# Altium project MAX96724_COUPON.PrjPcb
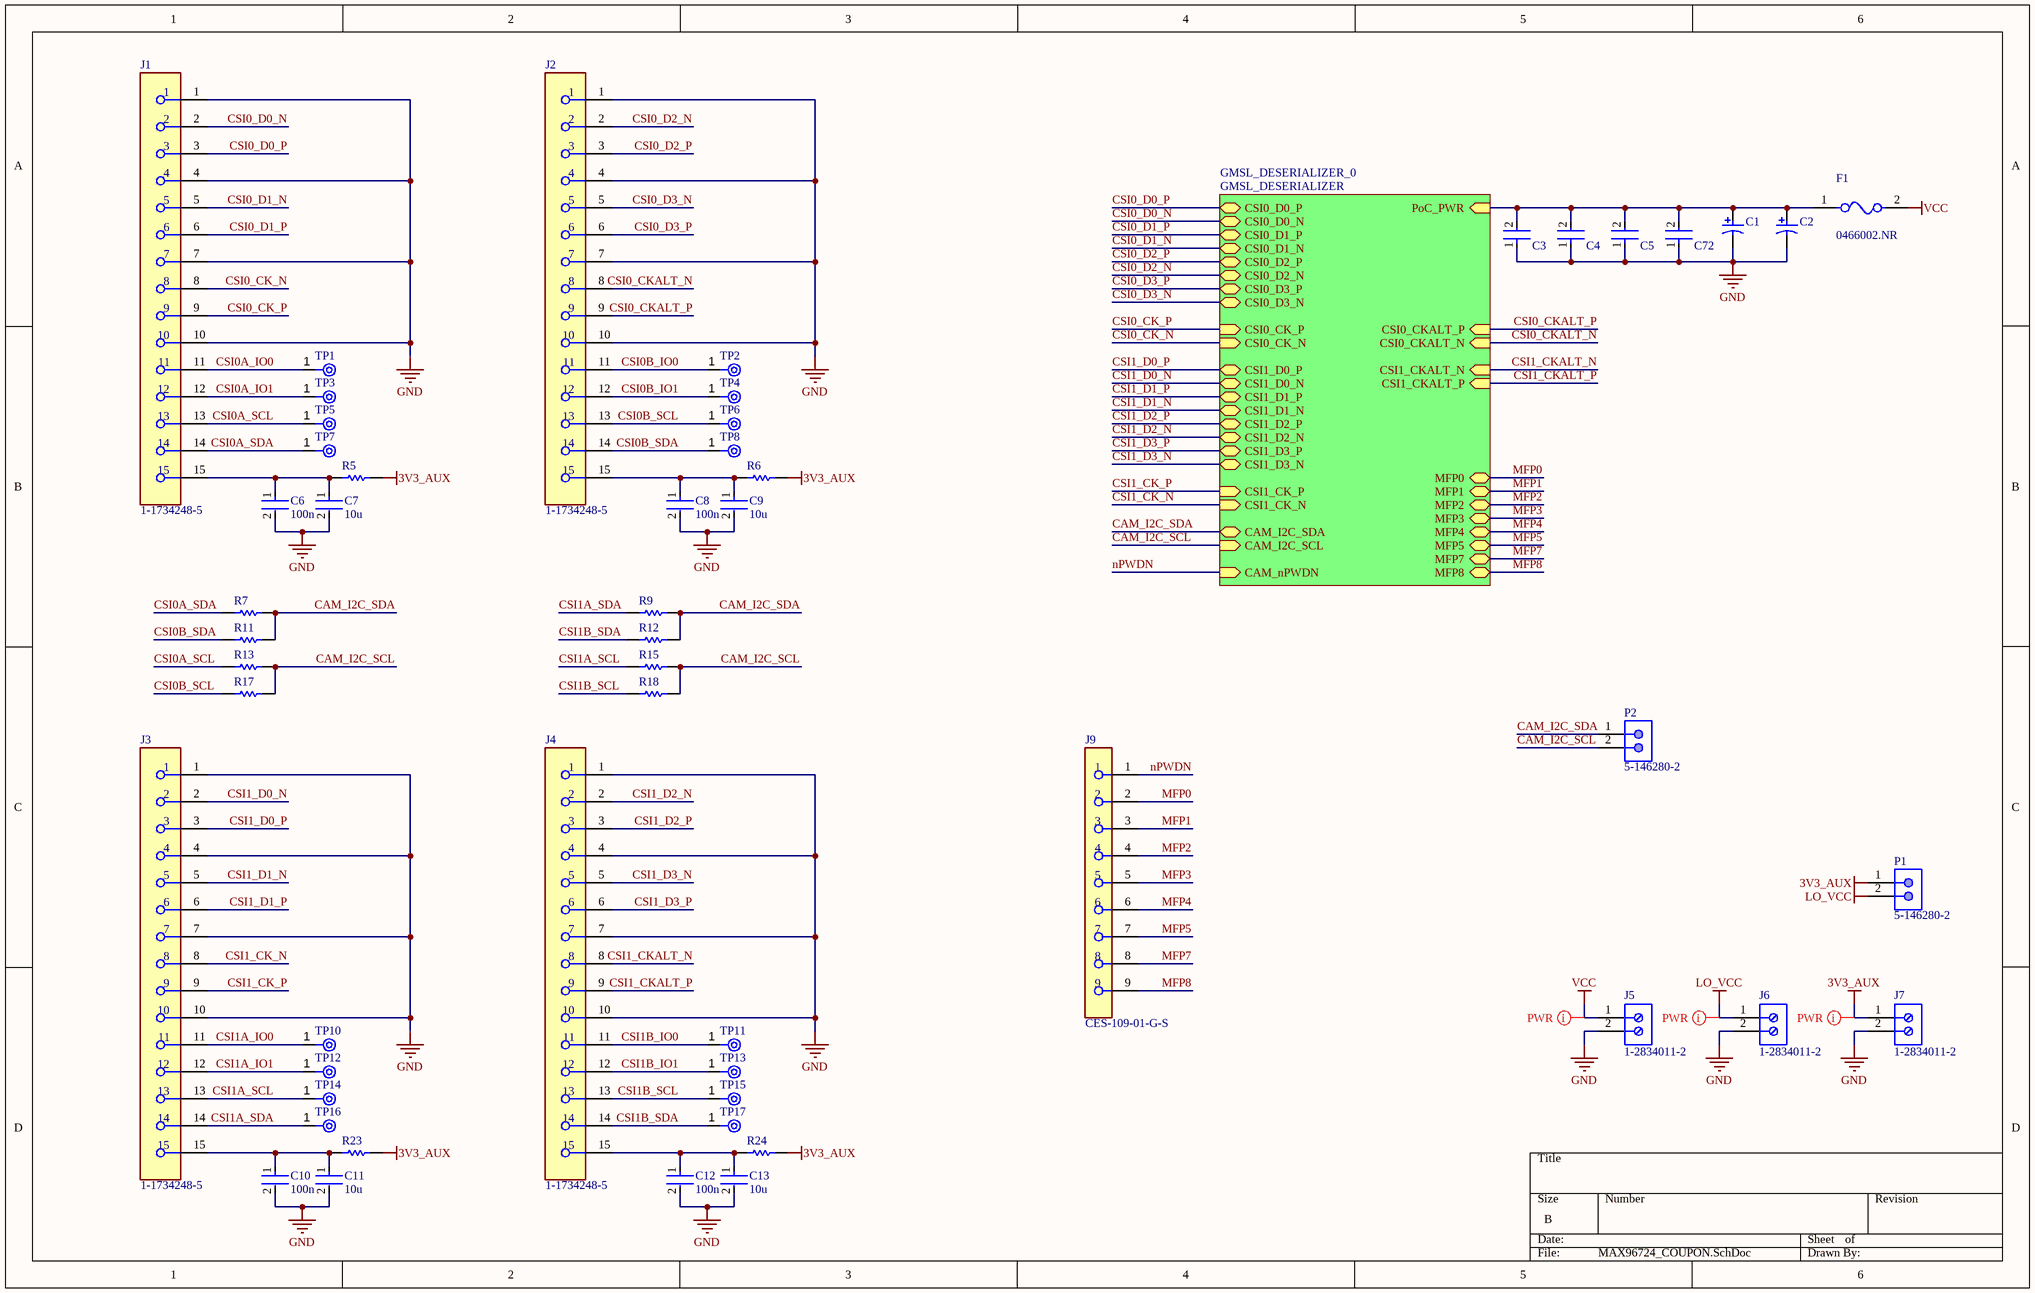
[diagram p0: MAX96724_COUPON.SchDoc]
2 sheets, 172 parts. Net scope: hierarchical (ports join the sheet entries above them; power ports are global).
Board file: MAX96724_COUPON.PcbDoc
Sheets:
  MAX96724_COUPON.SchDoc
    GMSL_DESERIALIZER_0 = GMSL_DESERIALIZER.SchDoc

## Sheet MAX96724_COUPON.SchDoc
size B; SheetNumber: 1; SheetTotal: 2

### Parts
C1  EEEFK1E101XP  [PNSC-FK-V-D8_V]  (value not drawn)
C2  EEEFK1E101XP  [PNSC-FK-V-D8_V]  (value not drawn)
C3  GRM21BR61E226ME44L  [FP-GRM21B-0_2-e0_2_0_7-IPC_B]  (value not drawn)
C4  GRM21BR61E226ME44L  [FP-GRM21B-0_2-e0_2_0_7-IPC_B]  (value not drawn)
C5  GRM21BR61E226ME44L  [FP-GRM21B-0_2-e0_2_0_7-IPC_B]  (value not drawn)
C6  100n  [FP-0402-L_1_0_0_05-W_0_5-IPC_A]
C7  10u  [FP-0402-L_1_0_0_05-W_0_5-IPC_A]
C8  100n  [FP-0402-L_1_0_0_05-W_0_5-IPC_A]
C9  10u  [FP-0402-L_1_0_0_05-W_0_5-IPC_A]
C10  100n  [FP-0402-L_1_0_0_05-W_0_5-IPC_A]
C11  10u  [FP-0402-L_1_0_0_05-W_0_5-IPC_A]
C12  100n  [FP-0402-L_1_0_0_05-W_0_5-IPC_A]
C13  10u  [FP-0402-L_1_0_0_05-W_0_5-IPC_A]
C72  GRM21BR61E226ME44L  [FP-GRM21B-0_2-e0_2_0_7-IPC_B]  (value not drawn)
F1  0466002.NR  [FP-0466-MFG]
J1  1-1734248-5  [FP-1-1734248-5-MFG]
J2  1-1734248-5  [FP-1-1734248-5-MFG]
J3  1-1734248-5  [FP-1-1734248-5-MFG]
J4  1-1734248-5  [FP-1-1734248-5-MFG]
J5  1-2834011-2  [1-2834011-2-Footprint-1]
J6  1-2834011-2  [1-2834011-2-Footprint-1]
J7  1-2834011-2  [1-2834011-2-Footprint-1]
J9  CES-109-01-G-S  [FP-CES-109-01-G-S-MFG]
P1  5-146280-2  [TECO-5-146280-2_V]
P2  5-146280-2  [TECO-5-146280-2_V]
R5  RC0402JR-070RL  [RESC1005X40X25NL05T10]  (value not drawn)
R6  RC0402JR-070RL  [RESC1005X40X25NL05T10]  (value not drawn)
R7  RC0402JR-070RL  [RESC1005X40X25NL05T10]  (value not drawn)
R9  RC0402JR-070RL  [RESC1005X40X25NL05T10]  (value not drawn)
R11  RC0402JR-070RL  [RESC1005X40X25NL05T10]  (value not drawn)
R12  RC0402JR-070RL  [RESC1005X40X25NL05T10]  (value not drawn)
R13  RC0402JR-070RL  [RESC1005X40X25NL05T10]  (value not drawn)
R15  RC0402JR-070RL  [RESC1005X40X25NL05T10]  (value not drawn)
R17  RC0402JR-070RL  [RESC1005X40X25NL05T10]  (value not drawn)
R18  RC0402JR-070RL  [RESC1005X40X25NL05T10]  (value not drawn)
R23  RC0402JR-070RL  [RESC1005X40X25NL05T10]  (value not drawn)
R24  RC0402JR-070RL  [RESC1005X40X25NL05T10]  (value not drawn)
TP1  TPAD6R  [New footprint 1]  (value not drawn)
TP2  TPAD6R  [New footprint 1]  (value not drawn)
TP3  TPAD6R  [New footprint 1]  (value not drawn)
TP4  TPAD6R  [New footprint 1]  (value not drawn)
TP5  TPAD6R  [New footprint 1]  (value not drawn)
TP6  TPAD6R  [New footprint 1]  (value not drawn)
TP7  TPAD6R  [New footprint 1]  (value not drawn)
TP8  TPAD6R  [New footprint 1]  (value not drawn)
TP10  TPAD6R  [New footprint 1]  (value not drawn)
TP11  TPAD6R  [New footprint 1]  (value not drawn)
TP12  TPAD6R  [New footprint 1]  (value not drawn)
TP13  TPAD6R  [New footprint 1]  (value not drawn)
TP14  TPAD6R  [New footprint 1]  (value not drawn)
TP15  TPAD6R  [New footprint 1]  (value not drawn)
TP16  TPAD6R  [New footprint 1]  (value not drawn)
TP17  TPAD6R  [New footprint 1]  (value not drawn)

### Sub-sheets
GMSL_DESERIALIZER_0 = GMSL_DESERIALIZER: CSI0_D0_P (bidir), CSI0_D0_N (bidir), CSI0_D1_P (bidir), CSI0_D1_N (bidir), CSI0_D2_P (bidir), CSI0_D2_N (bidir), CSI0_D3_P (bidir), CSI0_D3_N (bidir), CSI0_CK_P (in), CSI0_CK_N (in), CSI1_D0_P (bidir), CSI1_D0_N (bidir), CSI1_D1_P (bidir), CSI1_D1_N (bidir), CSI1_D2_P (bidir), CSI1_D2_N (bidir), CSI1_D3_P (bidir), CSI1_D3_N (bidir), CSI1_CK_P (in), CSI1_CK_N (in), CAM_I2C_SDA (bidir), CAM_I2C_SCL (in), CAM_nPWDN (in), PoC_PWR (in), MFP0 (bidir), MFP1 (bidir), MFP2 (bidir), MFP3 (bidir), MFP4 (bidir), MFP5 (bidir), MFP7 (bidir), MFP8 (bidir), CSI0_CKALT_P (in), CSI0_CKALT_N (in), CSI1_CKALT_P (in), CSI1_CKALT_N (in)

### Nets
3V3_AUX: J7.1 P1.1 R5.2 R6.2 R23.2 R24.2
GND: C1.2 C2.2 C3.1 C4.1 C5.1 C6.2 C7.2 C8.2 C9.2 C10.2 C11.2 C12.2 C13.2 C72.1 J1.1 J1.4 J1.7 J1.10 J2.1 J2.4 J2.7 J2.10 J3.1 J3.4 J3.7 J3.10 J4.1 J4.4 J4.7 J4.10 J5.2 J6.2 J7.2
LO_VCC: J6.1 P1.2
VCC: F1.2 J5.1
CAM_I2C_SCL: P2.2 R13.2 R15.2 R17.2 R18.2 ; sheet GMSL_DESERIALIZER_0/CAM_I2C_SCL
CAM_I2C_SDA: P2.1 R7.2 R9.2 R11.2 R12.2 ; sheet GMSL_DESERIALIZER_0/CAM_I2C_SDA
CSI0_CK_N: J1.8 ; sheet GMSL_DESERIALIZER_0/CSI0_CK_N
CSI0_CK_P: J1.9 ; sheet GMSL_DESERIALIZER_0/CSI0_CK_P
CSI0_CKALT_N: J2.8 ; sheet GMSL_DESERIALIZER_0/CSI0_CKALT_N
CSI0_CKALT_P: J2.9 ; sheet GMSL_DESERIALIZER_0/CSI0_CKALT_P
CSI0_D0_N: J1.2 ; sheet GMSL_DESERIALIZER_0/CSI0_D0_N
CSI0_D0_P: J1.3 ; sheet GMSL_DESERIALIZER_0/CSI0_D0_P
CSI0_D1_N: J1.5 ; sheet GMSL_DESERIALIZER_0/CSI0_D1_N
CSI0_D1_P: J1.6 ; sheet GMSL_DESERIALIZER_0/CSI0_D1_P
CSI0_D2_N: J2.2 ; sheet GMSL_DESERIALIZER_0/CSI0_D2_N
CSI0_D2_P: J2.3 ; sheet GMSL_DESERIALIZER_0/CSI0_D2_P
CSI0_D3_N: J2.5 ; sheet GMSL_DESERIALIZER_0/CSI0_D3_N
CSI0_D3_P: J2.6 ; sheet GMSL_DESERIALIZER_0/CSI0_D3_P
CSI0A_IO0: J1.11 TP1.1(TP)
CSI0A_IO1: J1.12 TP3.1(TP)
CSI0A_SCL: J1.13 R13.1 TP5.1(TP)
CSI0A_SDA: J1.14 R7.1 TP7.1(TP)
CSI0B_IO0: J2.11 TP2.1(TP)
CSI0B_IO1: J2.12 TP4.1(TP)
CSI0B_SCL: J2.13 R17.1 TP6.1(TP)
CSI0B_SDA: J2.14 R11.1 TP8.1(TP)
CSI1_CK_N: J3.8 ; sheet GMSL_DESERIALIZER_0/CSI1_CK_N
CSI1_CK_P: J3.9 ; sheet GMSL_DESERIALIZER_0/CSI1_CK_P
CSI1_CKALT_N: J4.8 ; sheet GMSL_DESERIALIZER_0/CSI1_CKALT_N
CSI1_CKALT_P: J4.9 ; sheet GMSL_DESERIALIZER_0/CSI1_CKALT_P
CSI1_D0_N: J3.2 ; sheet GMSL_DESERIALIZER_0/CSI1_D0_N
CSI1_D0_P: J3.3 ; sheet GMSL_DESERIALIZER_0/CSI1_D0_P
CSI1_D1_N: J3.5 ; sheet GMSL_DESERIALIZER_0/CSI1_D1_N
CSI1_D1_P: J3.6 ; sheet GMSL_DESERIALIZER_0/CSI1_D1_P
CSI1_D2_N: J4.2 ; sheet GMSL_DESERIALIZER_0/CSI1_D2_N
CSI1_D2_P: J4.3 ; sheet GMSL_DESERIALIZER_0/CSI1_D2_P
CSI1_D3_N: J4.5 ; sheet GMSL_DESERIALIZER_0/CSI1_D3_N
CSI1_D3_P: J4.6 ; sheet GMSL_DESERIALIZER_0/CSI1_D3_P
CSI1A_IO0: J3.11 TP10.1(TP)
CSI1A_IO1: J3.12 TP12.1(TP)
CSI1A_SCL: J3.13 R15.1 TP14.1(TP)
CSI1A_SDA: J3.14 R9.1 TP16.1(TP)
CSI1B_IO0: J4.11 TP11.1(TP)
CSI1B_IO1: J4.12 TP13.1(TP)
CSI1B_SCL: J4.13 R18.1 TP15.1(TP)
CSI1B_SDA: J4.14 R12.1 TP17.1(TP)
MFP0: J9.2 ; sheet GMSL_DESERIALIZER_0/MFP0
MFP1: J9.3 ; sheet GMSL_DESERIALIZER_0/MFP1
MFP2: J9.4 ; sheet GMSL_DESERIALIZER_0/MFP2
MFP3: J9.5 ; sheet GMSL_DESERIALIZER_0/MFP3
MFP4: J9.6 ; sheet GMSL_DESERIALIZER_0/MFP4
MFP5: J9.7 ; sheet GMSL_DESERIALIZER_0/MFP5
MFP7: J9.8 ; sheet GMSL_DESERIALIZER_0/MFP7
MFP8: J9.9 ; sheet GMSL_DESERIALIZER_0/MFP8
nPWDN: J9.1 ; sheet GMSL_DESERIALIZER_0/CAM_nPWDN
PoC_PWR: C1.1 C2.1 C3.2 C4.2 C5.2 C72.2 F1.1 ; sheet GMSL_DESERIALIZER_0/PoC_PWR
NetC6_1: C6.1 C7.1 J1.15 R5.1
NetC8_1: C8.1 C9.1 J2.15 R6.1
NetC10_1: C10.1 C11.1 J3.15 R23.1
NetC12_1: C12.1 C13.1 J4.15 R24.1

### Layout directives
net class PWR: 3V3_AUX, LO_VCC, VCC

### Library data of the parts
C1 C2 = CMP-2000-06206-1: Aluminum Electrolytic Capacitor, 100 uF, +/- 20%, 25 V, 2-Pin SMD (Size Code D8), -55 to 105 degC, RoHS, Tape and Reel; Manufacturer: Panasonic; Type: Can; Lifetime@Temperature: 2000Hrs@105°C; Capacitance: 100µF; Rated Voltage: 25V; Ripple Current: 280mA; Impedance: 0.34O; Case Size/Dimension: Ø6.3x7.7mm; Operating Temp-Max: 105°C; Series: FK; Package URL: http://industrial.panasonic.com/cdbs/www-data/pdf/RDE0000/DME0000COL48.pdf; Mounting Technology: SurfaceMount; Package Description: 2-Pin Electrolytic Aluminum Capacitor, Body 6.6 x 6.6 mm; Datasheet Version: 03/2016; Datasheet URL: http://industrial.panasonic.com/cdbs/www-data/pdf/RDE0000/ABA0000C1181.pdf; Manufacturer URL: http://www.panasonic.com/; Package Reference: FK-V-D8; Operating Temp Range: -55to+105°C
C3-C5 C72 = CMP-2007-03222-3: Chip Multilayer Ceramic Capacitors for General Purpose, 0805, 22uF, X5R, 15%, 20%, 25V; Case/Package: 0805; Depth: 1.25mm; Resistor Type: Ceramic; Voltage Rating: 25V; Lead Free: Lead Free; Voltage Rating (DC): 25V; Case Code (Metric): 2012; Thickness: 0.057inch; REACH SVHC: No SVHC; Material: Ceramic; Tolerance: 20%; Length: 2mm; Capacitance: 22uF; Case Code (Imperial): 0805; Max Operating Temperature: 85°C; Termination: SMD/SMT; Weight: 0.000335oz; Dielectric: X5R; Packaging: Tape and Reel; Voltage: 25V; Package Quantity: 3000; Height: 1.25mm; Mount: Surface Mount; Width: 1.25mm; Min Operating Temperature: -55°C
C6-C13 = CMP-001-00058-1: LARGE PADS, 0402 CAP, CHANGE COMMENT TO MATCH REAL P/N; Capacitor Type: Ceramic; Min Operating Temperature: -55°C; Mounting Technology: Surface Mount; Pins: 2; Case/Package: 0402; RoHS Compliant: Yes; Max Operating Temperature: 85°C
F1 = CMP-2000-05742-2: FUSE BOARD MNT 2A 63VAC/VDC 1206; Manufacturer: Littelfuse; Max Fuse Dc Voltage: 63V; Fuse I2T: 0.2326A2Sec; Fuse Voltage Drop: 78.73mV; Fuse Interrupt Ac Current: 50A; Resistance: 0.03Ω; Value: 0.03Ω; Fuse Blow Speed: Fast; Temperature Range Low: -55°C; Octopart: https://octopart.com/0466002.nr-littelfuse-566006; Category: Fuse; Digikey Description: FUSE BOARD MNT 2A 63VAC/VDC 1206; Height: 0.66mm; Temperature: -55°C to +90°C; ComponentLink2URL: https://www.littelfuse.com/~/media/electronics/datasheets/fuses/littelfuse_fuse_466_datasheet.pdf.pdf; Device Class L3: unset; Device Class L2: Fuses; Device Class L1: Circuit Protection; Lead Free: Yes; Mouser Description: 466 Series Very Fast-Acting 63 V 2 A 1206 Surface Mount Thin Film Fuse; Package: 0466; Fuse Current: 2A; Temperature Range High: +90°C; Voltage Rating: 63V; Manufacturer Part Number: 0466002.NR; Automotive: No; Max Fuse Ac Voltage: 63V; ComponentLink2Description: Datasheet; RoHS: TRUE; Fuse Interrupt Dc Current: 50A
J1-J4 = CMP-03368-000001-1: CONN FPC VERT 15POS 1.00MM SMD; Manufacturer: TE; Conn Orientation: Vertical; Conn Gender: Female; Current Rating: 1A; Is Female: yes; Number Of Contacts: 15; Pitch: 1mm; Voltage Rating: 125V; ComponentLink2URL: https://www.te.com/commerce/DocumentDelivery/DDEController?Action=showdoc&DocId=Customer+Drawing%7F1734248%7FE1%7Fpdf%7FEnglish%7FENG_CD_1734248_E1__.pdf%7F1-1734248-5; Device Class L1: Connectors; Category: Conn; Package: 0; Lead Free: Yes; Digikey Description: CONN FPC VERT 15POS 1.00MM SMD; Height: 8mm; Manufacturer Part Number: 1-1734248-5; Temperature: -20°C to +85°C; Contact Material: Gold,Nickel; Device Class L3: unset; ComponentLink2Description: Datasheet; RoHS: TRUE; Temperature Range Low: -20°C; Octopart: https://octopart.com/1-1734248-5-te+connectivity-40620898; Device Class L2: FFC / FPC; Mouser Description: FFC & FPC Connectors 15P 1.0 FPC, Zip V/T SMT; Automotive: No; Temperature Range High: +85°C; Mounting Type: Surface Mount
J5-J7 = CMP-002-00067-1: Barrier Strip Terminal Block; RoHS Compliant: Yes
J9 = CMP-00575-09340057-1: CES-109-01-G-S Conn Socket Strip SKT 9 POS 2.54mm Solder ST Top Entry Thru-Hole Tube; Manufacturer Lifecycle Status: PRODUCTION; Current Rating: 5.5A; Max Current Rating: 1A; Number of Contacts: 9; Max Voltage Rating (AC): 333V; Voltage Rating: 400V; Gender: Receptacle; Contact Resistance: 10mΩ; Depth: 3.05mm; NexarPartId: 9340057; Contact Plating: Gold; Termination: Solder; Housing Color: Black; REACH SVHC: No SVHC; Contact Material: Bronze, Gold, Nickel; Min Operating Temperature: -55°C; Radiation Hardening: No; Orientation: Straight; Length: 22.86mm; RoHS: Compliant; Housing Material: Polyester; Lifecycle Status: Production; Max Operating Temperature: 125°C; Pitch: 2.54mm; Height: 5.21mm; Number of Rows: 1
P1 P2 = CMP-2000-07492-1: Male Header, Pitch 2.54 mm, 1 x 2 Position, Height 8.21 mm, Tail Length 3.05 mm, -65 to 105 degC, RoHS, Bulk; Manufacturer: TE Connectivity; Mating Connector Lock: No(Without); Number of Positions: 2; Pitch: 2.54mm; PCB Mounting Orientation: Vertical; Keyed: No; Case\/Package: 100; Mating Post Length: 0.23inch; High Temperature Housing: Yes; Max Current Rating: 5A; PCB Thickness: 0.063inch; PCB Mount Retention: Without; Approvals: CSA; Current Rating: 3A; Radiation Hardening: No; Length: 4.67mm; Contact Mating Length: 0.23inch; Connector Type: Header; Number of Rows: 1; Termination Post Length: 0.12inch; Board Standoff: No(Without); Max Operating Temperature: 105degC; Contact Shape: Square; Selectively Loaded: No(Without); Gasket: No(Without); Number of Contacts: 2; Contact Gender: Male; Mating Alignment: No(Without); Manufacturer URL: http://www.te.com/; Datasheet URL: http://www.te.com/commerce/DocumentDelivery/DDEController?Action=showdoc&DocId=Customer+Drawing%7F146280%7FH1%7Fpdf%7FEnglish%7FENG_CD_146280_H1.pdf%7F5-146280-2; Mount: ThroughHole; Orientation: Straight; Packaging: Carton; Package Reference: 5-146280-2; Package Quantity: 500; Stabilizers: No(Without); Row Spacing: 2.54mm; Contact Material: CopperAlloy; Panel Mount Retention: No(Without); Datasheet Version: Rev. H1, 08/2016; Housing Colour: Black; Colour: Black; Package Description: Male Header, Pitch 2.54 mm, 1 x 2 Position, Height 8.21 mm, Tail Length 3.05 mm; Contact Plating: Matte; Housing Material: Polymer; Contact Protection: No(Without); Min Operating Temperature: -65degC; Mounting Technology: ThroughHole; Flammability Rating: UL94V-0; RoHSCompliant: true; Termination: ThroughHole; Depth: 2.34mm; High Speed Serial Data Connector: No
R5-R7 R9 R11-R13 R15 R17 R18 R23 R24 = CMP-1011-00001-2: Manufacturer: Yageo / Phycomp; Part Number: RC0402JR-070RL
TP1-TP8 TP10-TP17 = CMP-00025-2: Test Point .6mm

## Sheet GMSL_DESERIALIZER.SchDoc
size C; SheetNumber: 2; SheetTotal: 2
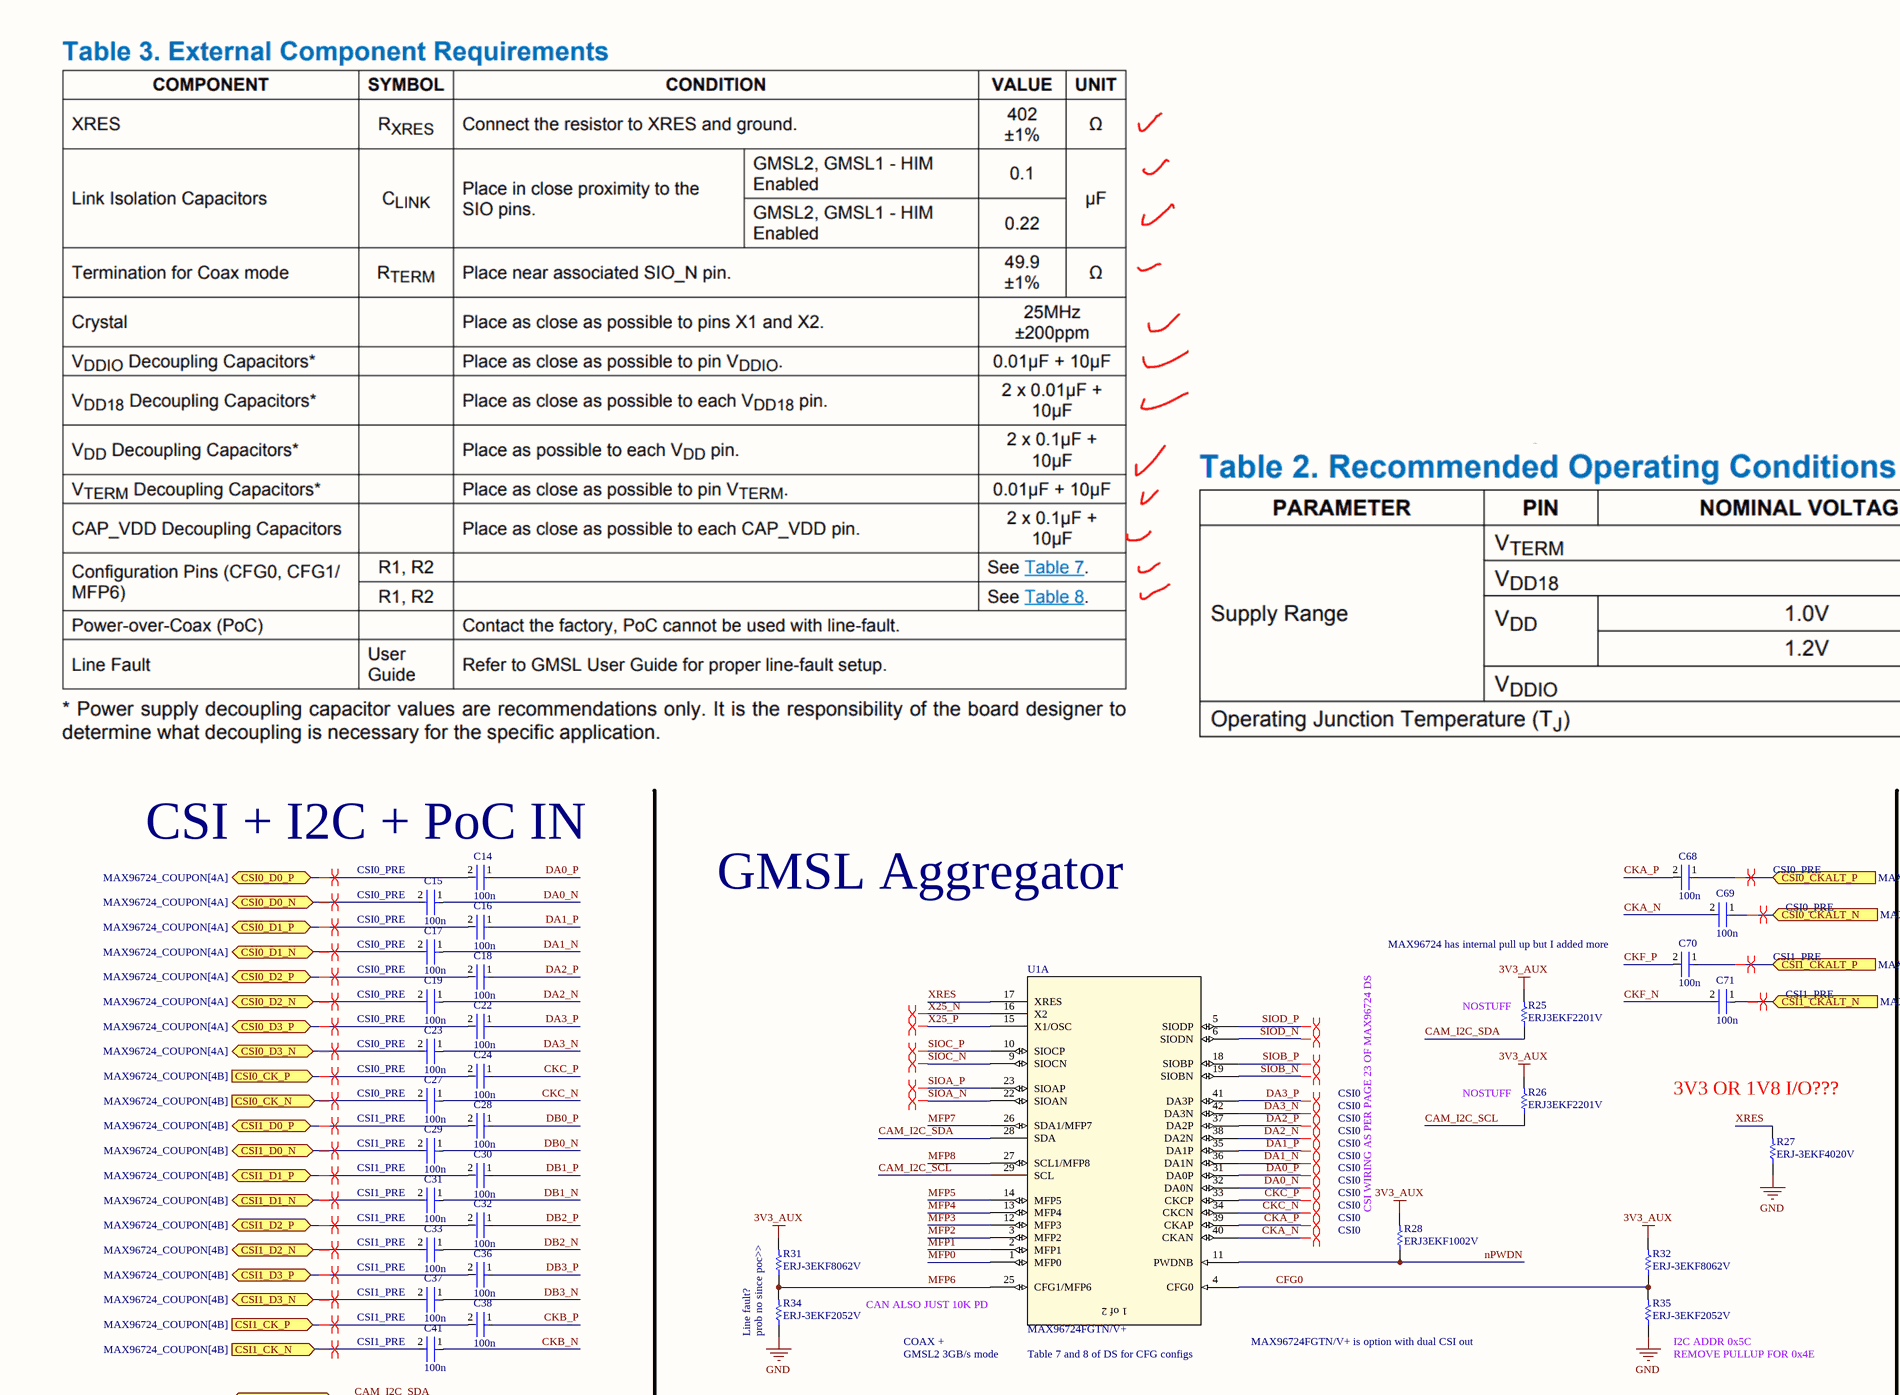
[diagram p1: GMSL_DESERIALIZER.SchDoc, top left]
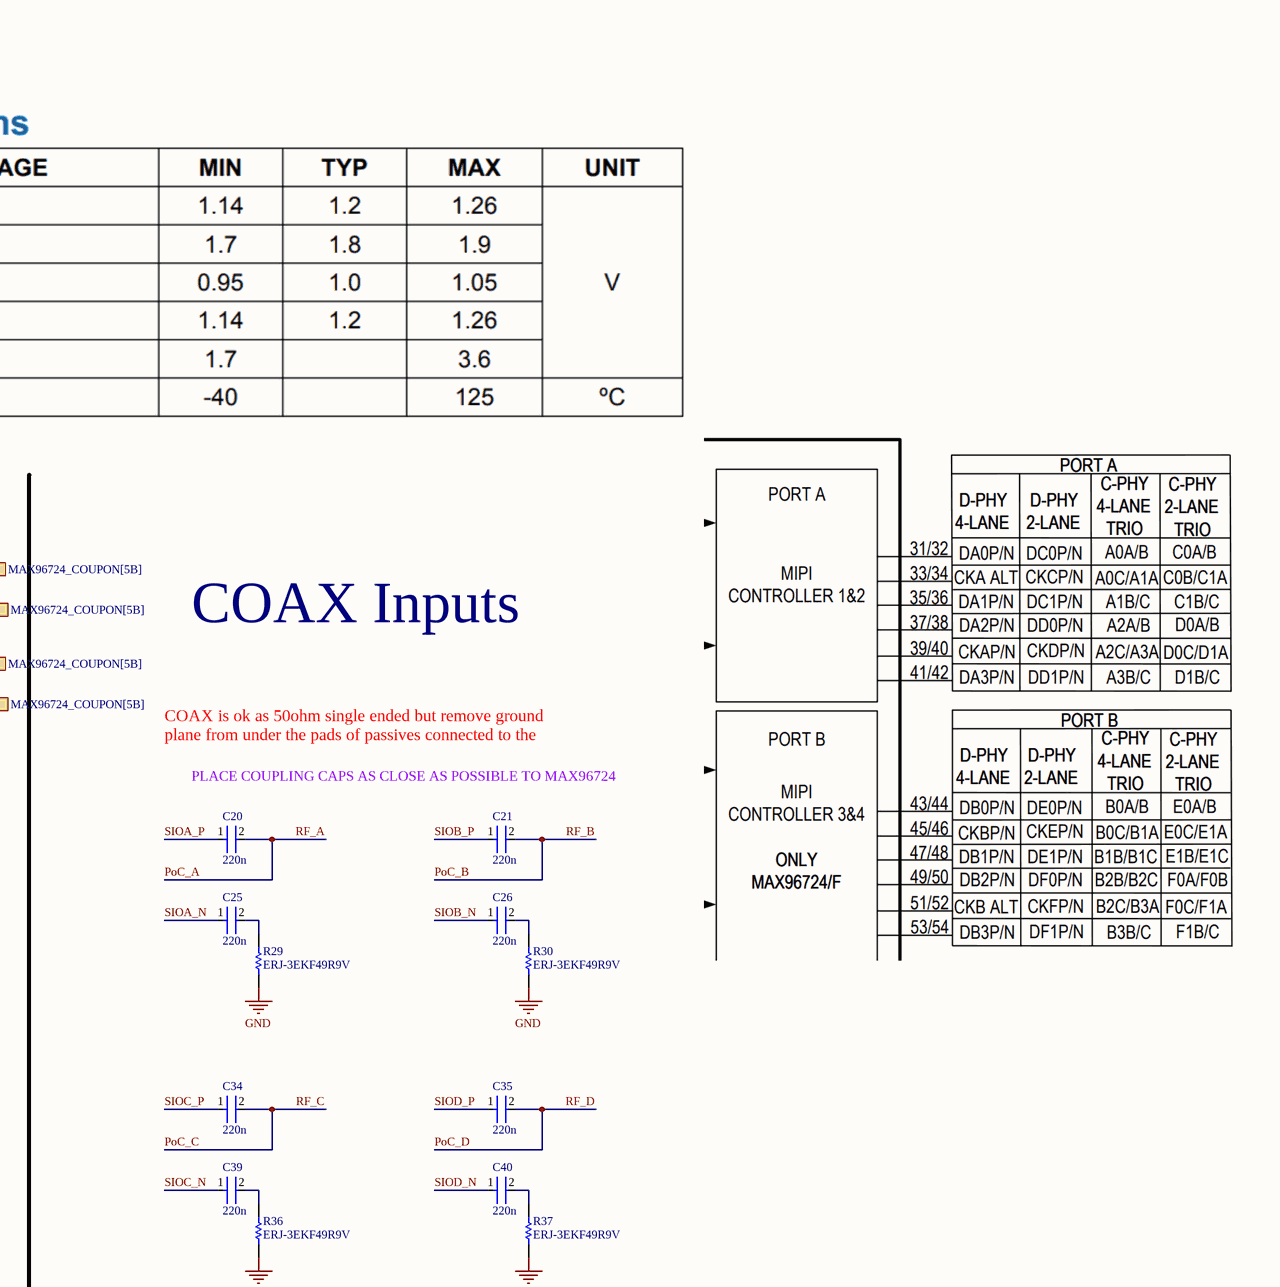
[diagram p2: GMSL_DESERIALIZER.SchDoc, top right]
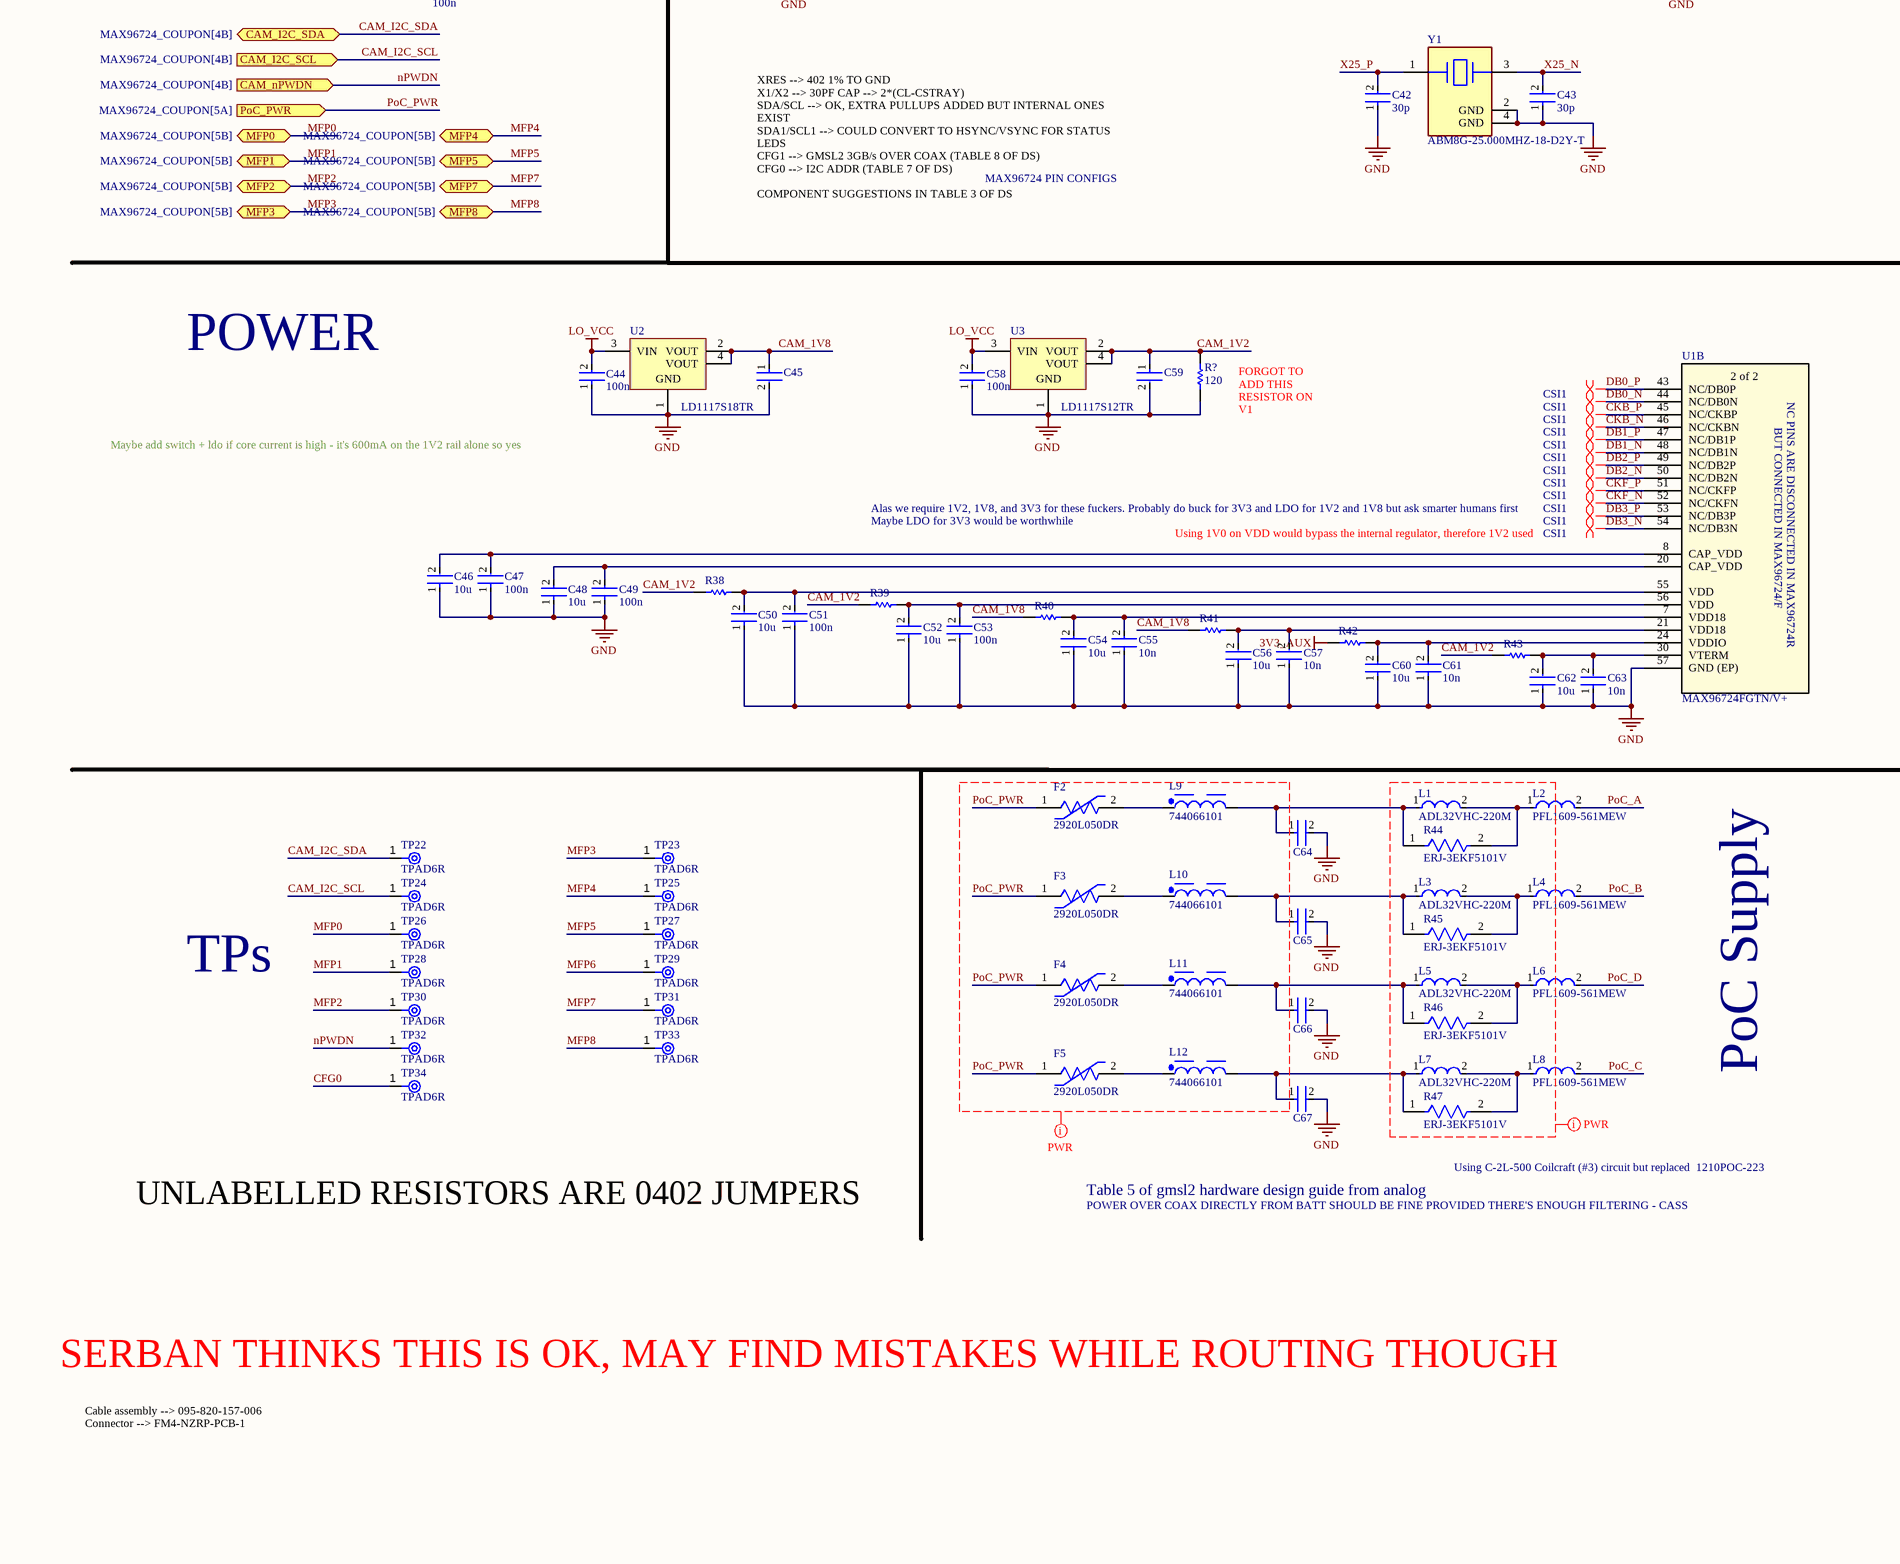
[diagram p3: GMSL_DESERIALIZER.SchDoc, bottom left]
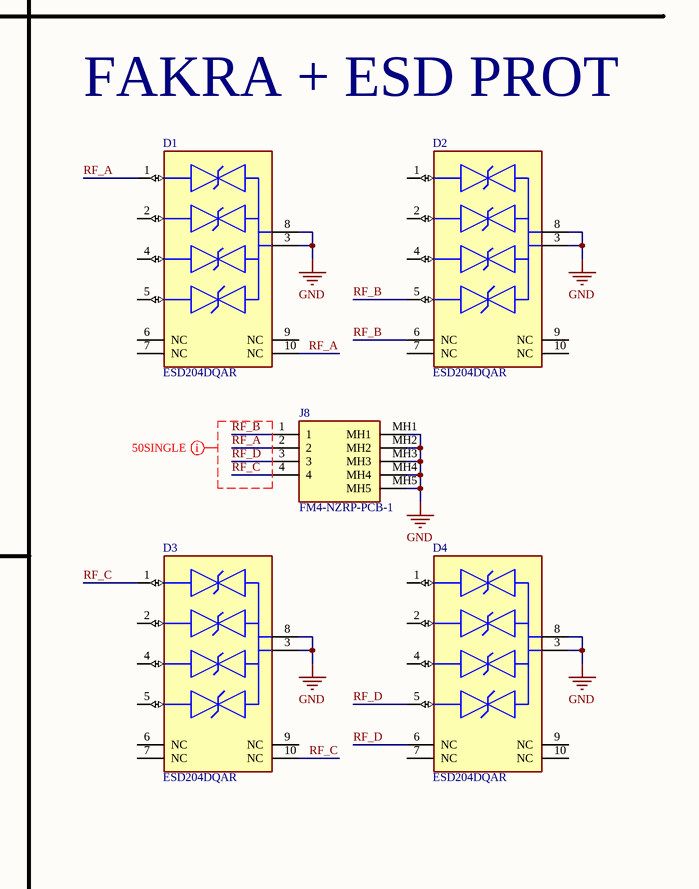
[diagram p4: GMSL_DESERIALIZER.SchDoc, bottom right]

### Parts
C14  100n  [FP-0402-L_1_0_0_05-W_0_5-IPC_A]
C15  100n  [FP-0402-L_1_0_0_05-W_0_5-IPC_A]
C16  100n  [FP-0402-L_1_0_0_05-W_0_5-IPC_A]
C17  100n  [FP-0402-L_1_0_0_05-W_0_5-IPC_A]
C18  100n  [FP-0402-L_1_0_0_05-W_0_5-IPC_A]
C19  100n  [FP-0402-L_1_0_0_05-W_0_5-IPC_A]
C20  220n  [FP-0402-L_1_0_0_05-W_0_5-IPC_A]
C21  220n  [FP-0402-L_1_0_0_05-W_0_5-IPC_A]
C22  100n  [FP-0402-L_1_0_0_05-W_0_5-IPC_A]
C23  100n  [FP-0402-L_1_0_0_05-W_0_5-IPC_A]
C24  100n  [FP-0402-L_1_0_0_05-W_0_5-IPC_A]
C25  220n  [FP-0402-L_1_0_0_05-W_0_5-IPC_A]
C26  220n  [FP-0402-L_1_0_0_05-W_0_5-IPC_A]
C27  100n  [FP-0402-L_1_0_0_05-W_0_5-IPC_A]
C28  100n  [FP-0402-L_1_0_0_05-W_0_5-IPC_A]
C29  100n  [FP-0402-L_1_0_0_05-W_0_5-IPC_A]
C30  100n  [FP-0402-L_1_0_0_05-W_0_5-IPC_A]
C31  100n  [FP-0402-L_1_0_0_05-W_0_5-IPC_A]
C32  100n  [FP-0402-L_1_0_0_05-W_0_5-IPC_A]
C33  100n  [FP-0402-L_1_0_0_05-W_0_5-IPC_A]
C34  220n  [FP-0402-L_1_0_0_05-W_0_5-IPC_A]
C35  220n  [FP-0402-L_1_0_0_05-W_0_5-IPC_A]
C36  100n  [FP-0402-L_1_0_0_05-W_0_5-IPC_A]
C37  100n  [FP-0402-L_1_0_0_05-W_0_5-IPC_A]
C38  100n  [FP-0402-L_1_0_0_05-W_0_5-IPC_A]
C39  220n  [FP-0402-L_1_0_0_05-W_0_5-IPC_A]
C40  220n  [FP-0402-L_1_0_0_05-W_0_5-IPC_A]
C41  100n  [FP-0402-L_1_0_0_05-W_0_5-IPC_A]
C42  30p  [FP-0402-L_1_0_0_05-W_0_5-IPC_A]
C43  30p  [FP-0402-L_1_0_0_05-W_0_5-IPC_A]
C44  100n  [FP-0402-L_1_0_0_05-W_0_5-IPC_A]
C45  GRM188R60J106ME47D  [FP-GRM188-0_1-e0_2_0_55-IPC_A]  (value not drawn)
C46  10u  [FP-0402-L_1_0_0_05-W_0_5-IPC_A]
C47  100n  [FP-0402-L_1_0_0_05-W_0_5-IPC_A]
C48  10u  [FP-0402-L_1_0_0_05-W_0_5-IPC_A]
C49  100n  [FP-0402-L_1_0_0_05-W_0_5-IPC_A]
C50  10u  [FP-0402-L_1_0_0_05-W_0_5-IPC_A]
C51  100n  [FP-0402-L_1_0_0_05-W_0_5-IPC_A]
C52  10u  [FP-0402-L_1_0_0_05-W_0_5-IPC_A]
C53  100n  [FP-0402-L_1_0_0_05-W_0_5-IPC_A]
C54  10u  [FP-0402-L_1_0_0_05-W_0_5-IPC_A]
C55  10n  [FP-0402-L_1_0_0_05-W_0_5-IPC_A]
C56  10u  [FP-0402-L_1_0_0_05-W_0_5-IPC_A]
C57  10n  [FP-0402-L_1_0_0_05-W_0_5-IPC_A]
C58  100n  [FP-0402-L_1_0_0_05-W_0_5-IPC_A]
C59  GRM188R60J106ME47D  [FP-GRM188-0_1-e0_2_0_55-IPC_A]  (value not drawn)
C60  10u  [FP-0402-L_1_0_0_05-W_0_5-IPC_A]
C61  10n  [FP-0402-L_1_0_0_05-W_0_5-IPC_A]
C62  10u  [FP-0402-L_1_0_0_05-W_0_5-IPC_A]
C63  10n  [FP-0402-L_1_0_0_05-W_0_5-IPC_A]
C64  GRM21BR61E226ME44L  [FP-GRM21B-0_2-e0_2_0_7-IPC_B]  (value not drawn)
C65  GRM21BR61E226ME44L  [FP-GRM21B-0_2-e0_2_0_7-IPC_B]  (value not drawn)
C66  GRM21BR61E226ME44L  [FP-GRM21B-0_2-e0_2_0_7-IPC_B]  (value not drawn)
C67  GRM21BR61E226ME44L  [FP-GRM21B-0_2-e0_2_0_7-IPC_B]  (value not drawn)
C68  100n  [FP-0402-L_1_0_0_05-W_0_5-IPC_A]
C69  100n  [FP-0402-L_1_0_0_05-W_0_5-IPC_A]
C70  100n  [FP-0402-L_1_0_0_05-W_0_5-IPC_A]
C71  100n  [FP-0402-L_1_0_0_05-W_0_5-IPC_A]
D1  ESD204DQAR  [FP-DQA0010A-MFG]
D2  ESD204DQAR  [FP-DQA0010A-MFG]
D3  ESD204DQAR  [FP-DQA0010A-MFG]
D4  ESD204DQAR  [FP-DQA0010A-MFG]
F2  2920L050DR  [FP-2920L050DR-MFG]
F3  2920L050DR  [FP-2920L050DR-MFG]
F4  2920L050DR  [FP-2920L050DR-MFG]
F5  2920L050DR  [FP-2920L050DR-MFG]
J8  FM4-NZRP-PCB-1  [FM4-NZRP-PCB-1-Footprint-1]
L1  ADL32VHC-220M  [FP-1210POC-MFG]
L2  PFL1609-561MEW  [FP-PFL1609-MFG]
L3  ADL32VHC-220M  [FP-1210POC-MFG]
L4  PFL1609-561MEW  [FP-PFL1609-MFG]
L5  ADL32VHC-220M  [FP-1210POC-MFG]
L6  PFL1609-561MEW  [FP-PFL1609-MFG]
L7  ADL32VHC-220M  [FP-1210POC-MFG]
L8  PFL1609-561MEW  [FP-PFL1609-MFG]
L9  744066101  [WE-TPC_1038]
L10  744066101  [WE-TPC_1038]
L11  744066101  [WE-TPC_1038]
L12  744066101  [WE-TPC_1038]
R25  ERJ3EKF2201V  [RESC1608X55X30LL15T15]
R26  ERJ3EKF2201V  [RESC1608X55X30LL15T15]
R27  ERJ-3EKF4020V  [RESC1608X55X30LL15T15]
R28  ERJ3EKF1002V  [RESC1609X55X30LL15T15]
R29  ERJ-3EKF49R9V  [RESC1608X55X30ML15T15]
R30  ERJ-3EKF49R9V  [RESC1608X55X30ML15T15]
R31  ERJ-3EKF8062V  [RESC1608X55X30LL15T15]
R32  ERJ-3EKF8062V  [RESC1608X55X30LL15T15]
R34  ERJ-3EKF2052V  [RESC1608X55X30NL15T15]
R35  ERJ-3EKF2052V  [RESC1608X55X30NL15T15]
R36  ERJ-3EKF49R9V  [RESC1608X55X30ML15T15]
R37  ERJ-3EKF49R9V  [RESC1608X55X30ML15T15]
R38  RC0402JR-070RL  [RESC1005X40X25NL05T10]  (value not drawn)
R39  RC0402JR-070RL  [RESC1005X40X25NL05T10]  (value not drawn)
R40  RC0402JR-070RL  [RESC1005X40X25NL05T10]  (value not drawn)
R41  RC0402JR-070RL  [RESC1005X40X25NL05T10]  (value not drawn)
R42  RC0402JR-070RL  [RESC1005X40X25NL05T10]  (value not drawn)
R43  RC0402JR-070RL  [RESC1005X40X25NL05T10]  (value not drawn)
R44  ERJ-3EKF5101V  [FP-ERJ3EK-MFG]
R45  ERJ-3EKF5101V  [FP-ERJ3EK-MFG]
R46  ERJ-3EKF5101V  [FP-ERJ3EK-MFG]
R47  ERJ-3EKF5101V  [FP-ERJ3EK-MFG]
R?  120  [R0603B]
TP22  TPAD6R  [New footprint 1]
TP23  TPAD6R  [New footprint 1]
TP24  TPAD6R  [New footprint 1]
TP25  TPAD6R  [New footprint 1]
TP26  TPAD6R  [New footprint 1]
TP27  TPAD6R  [New footprint 1]
TP28  TPAD6R  [New footprint 1]
TP29  TPAD6R  [New footprint 1]
TP30  TPAD6R  [New footprint 1]
TP31  TPAD6R  [New footprint 1]
TP32  TPAD6R  [New footprint 1]
TP33  TPAD6R  [New footprint 1]
TP34  TPAD6R  [New footprint 1]
U1  MAX96724FGTN/V+  [MAX96724FGTN_V+-Footprint-1]  (parts A,B of 2)
U2  LD1117S18TR  [SOT-223_M]
U3  LD1117S12TR  [SOT-223_M]
Y1  ABM8G-25.000MHZ-18-D2Y-T  [FP-ABM8G-MFG]

### Ports
CAM_I2C_SCL (in, see MAX96724_COUPON[4B]), CAM_I2C_SDA (bidir, see MAX96724_COUPON[4B]), CAM_nPWDN (in, see MAX96724_COUPON[4B]), CSI0_CK_N (in, see MAX96724_COUPON[4B]), CSI0_CK_P (in, see MAX96724_COUPON[4B]), CSI0_CKALT_N (in, see MAX96724_COUPON[5B]), CSI0_CKALT_P (in, see MAX96724_COUPON[5B]), CSI0_D0_N (bidir, see MAX96724_COUPON[4A]), CSI0_D0_P (bidir, see MAX96724_COUPON[4A]), CSI0_D1_N (bidir, see MAX96724_COUPON[4A]), CSI0_D1_P (bidir, see MAX96724_COUPON[4A]), CSI0_D2_N (bidir, see MAX96724_COUPON[4A]), CSI0_D2_P (bidir, see MAX96724_COUPON[4A]), CSI0_D3_N (bidir, see MAX96724_COUPON[4A]), CSI0_D3_P (bidir, see MAX96724_COUPON[4A]), CSI1_CK_N (in, see MAX96724_COUPON[4B]), CSI1_CK_P (in, see MAX96724_COUPON[4B]), CSI1_CKALT_N (in, see MAX96724_COUPON[5B]), CSI1_CKALT_P (in, see MAX96724_COUPON[5B]), CSI1_D0_N (bidir, see MAX96724_COUPON[4B]), CSI1_D0_P (bidir, see MAX96724_COUPON[4B]), CSI1_D1_N (bidir, see MAX96724_COUPON[4B]), CSI1_D1_P (bidir, see MAX96724_COUPON[4B]), CSI1_D2_N (bidir, see MAX96724_COUPON[4B]), CSI1_D2_P (bidir, see MAX96724_COUPON[4B]), CSI1_D3_N (bidir, see MAX96724_COUPON[4B]), CSI1_D3_P (bidir, see MAX96724_COUPON[4B]), MFP0 (bidir, see MAX96724_COUPON[5B]), MFP1 (bidir, see MAX96724_COUPON[5B]), MFP2 (bidir, see MAX96724_COUPON[5B]), MFP3 (bidir, see MAX96724_COUPON[5B]), MFP4 (bidir, see MAX96724_COUPON[5B]), MFP5 (bidir, see MAX96724_COUPON[5B]), MFP7 (bidir, see MAX96724_COUPON[5B]), MFP8 (bidir, see MAX96724_COUPON[5B]), PoC_PWR (in, see MAX96724_COUPON[5A])

### Nets
3V3_AUX: R25.2 R26.2 R28.2 R31.2 R32.2 R42.1
GND: C42.1 C43.1 C44.1 C45.2 C46.1 C47.1 C48.1 C49.1 C50.1 C51.1 C52.1 C53.1 C54.1 C55.1 C56.1 C57.1 C58.1 C59.2 C60.1 C61.1 C62.1 C63.1 C64.2 C65.2 C66.2 C67.2 D1.3(GND) D1.8(GND) D2.3(GND) D2.8(GND) D3.3(GND) D3.8(GND) D4.3(GND) D4.8(GND) J8.MH1 J8.MH2 J8.MH3 J8.MH4 J8.MH5 R27.1 R29.1 R30.1 R34.1 R35.1 R36.1 R37.1 R?.2 U1.57(GND_(EP)) U2.1(GND) U3.1(GND) Y1.2(GND) Y1.4(GND)
LO_VCC: C44.2 C58.2 U2.3(VIN) U3.3(VIN)
CAM_1V2: C59.1 R38.1 R39.1 R43.1 R?.1 U3.2(VOUT) U3.4(VOUT)
CAM_1V8: C45.1 R40.1 R41.1 U2.2(VOUT) U2.4(VOUT)
CAM_I2C_SCL: R26.1 TP24.1(TP) U1.29(SCL) ; port CAM_I2C_SCL
CAM_I2C_SDA: R25.1 TP22.1(TP) U1.28(SDA) ; port CAM_I2C_SDA
CFG0: R32.1 R35.2 TP34.1(TP) U1.4(CFG0)
CKA_N: C69.2 U1.40(CKAN)
CKA_P: C68.2 U1.39(CKAP)
CKB_N: C41.1 U1.46(NC/CKBN)
CKB_P: C38.1 U1.45(NC/CKBP)
CKC_N: C27.1 U1.34(CKCN)
CKC_P: C24.1 U1.33(CKCP)
CKF_N: C71.2 U1.52(NC/CKFN)
CKF_P: C70.2 U1.51(NC/CKFP)
CSI0_CK_N: C27.2 ; port CSI0_CK_N
CSI0_CK_P: C24.2 ; port CSI0_CK_P
CSI0_CKALT_N: C69.1 ; port CSI0_CKALT_N
CSI0_CKALT_P: C68.1 ; port CSI0_CKALT_P
CSI0_D0_N: C15.2 ; port CSI0_D0_N
CSI0_D0_P: C14.2 ; port CSI0_D0_P
CSI0_D1_N: C17.2 ; port CSI0_D1_N
CSI0_D1_P: C16.2 ; port CSI0_D1_P
CSI0_D2_N: C19.2 ; port CSI0_D2_N
CSI0_D2_P: C18.2 ; port CSI0_D2_P
CSI0_D3_N: C23.2 ; port CSI0_D3_N
CSI0_D3_P: C22.2 ; port CSI0_D3_P
CSI1_CK_N: C41.2 ; port CSI1_CK_N
CSI1_CK_P: C38.2 ; port CSI1_CK_P
CSI1_CKALT_N: C71.1 ; port CSI1_CKALT_N
CSI1_CKALT_P: C70.1 ; port CSI1_CKALT_P
CSI1_D0_N: C29.2 ; port CSI1_D0_N
CSI1_D0_P: C28.2 ; port CSI1_D0_P
CSI1_D1_N: C31.2 ; port CSI1_D1_N
CSI1_D1_P: C30.2 ; port CSI1_D1_P
CSI1_D2_N: C33.2 ; port CSI1_D2_N
CSI1_D2_P: C32.2 ; port CSI1_D2_P
CSI1_D3_N: C37.2 ; port CSI1_D3_N
CSI1_D3_P: C36.2 ; port CSI1_D3_P
DA0_N: C15.1 U1.32(DA0N)
DA0_P: C14.1 U1.31(DA0P)
DA1_N: C17.1 U1.36(DA1N)
DA1_P: C16.1 U1.35(DA1P)
DA2_N: C19.1 U1.38(DA2N)
DA2_P: C18.1 U1.37(DA2P)
DA3_N: C23.1 U1.42(DA3N)
DA3_P: C22.1 U1.41(DA3P)
DB0_N: C29.1 U1.44(NC/DB0N)
DB0_P: C28.1 U1.43(NC/DB0P)
DB1_N: C31.1 U1.48(NC/DB1N)
DB1_P: C30.1 U1.47(NC/DB1P)
DB2_N: C33.1 U1.50(NC/DB2N)
DB2_P: C32.1 U1.49(NC/DB2P)
DB3_N: C37.1 U1.54(NC/DB3N)
DB3_P: C36.1 U1.53(NC/DB3P)
MFP0: TP26.1(TP) U1.1(MFP0) ; port MFP0
MFP1: TP28.1(TP) U1.2(MFP1) ; port MFP1
MFP2: TP30.1(TP) U1.3(MFP2) ; port MFP2
MFP3: TP23.1(TP) U1.12(MFP3) ; port MFP3
MFP4: TP25.1(TP) U1.13(MFP4) ; port MFP4
MFP5: TP27.1(TP) U1.14(MFP5) ; port MFP5
MFP6: R31.1 R34.2 TP29.1(TP) U1.25(CFG1/MFP6)
MFP7: TP31.1(TP) U1.26(SDA1/MFP7) ; port MFP7
MFP8: TP33.1(TP) U1.27(SCL1/MFP8) ; port MFP8
nPWDN: R28.1 TP32.1(TP) U1.11(PWDNB) ; port CAM_nPWDN
PoC_A: C20.2 D1.1(IO1) D1.10(NC) J8.2 L2.2  [also labelled RF_A]
PoC_B: C21.2 D2.5(IO4) D2.6(NC) J8.1 L4.2  [also labelled RF_B]
PoC_C: C34.2 D3.1(IO1) D3.10(NC) J8.4 L8.2  [also labelled RF_C]
PoC_D: C35.2 D4.5(IO4) D4.6(NC) J8.3 L6.2  [also labelled RF_D]
PoC_PWR: F2.1 F3.1 F4.1 F5.1 ; port PoC_PWR
SIOA_N: C25.1 U1.22(SIOAN)
SIOA_P: C20.1 U1.23(SIOAP)
SIOB_N: C26.1 U1.19(SIOBN)
SIOB_P: C21.1 U1.18(SIOBP)
SIOC_N: C39.1 U1.9(SIOCN)
SIOC_P: C34.1 U1.10(SIOCP)
SIOD_N: C40.1 U1.6(SIODN)
SIOD_P: C35.1 U1.5(SIODP)
X25_N: C43.2 U1.16(X2) Y1.3
X25_P: C42.2 U1.15(X1/OSC) Y1.1
XRES: R27.2 U1.17(XRES)
NetC25_2: C25.2 R29.2
NetC26_2: C26.2 R30.2
NetC39_2: C39.2 R36.2
NetC40_2: C40.2 R37.2
NetC46_2: C46.2 C47.2 U1.8(CAP_VDD)
NetC48_2: C48.2 C49.2 U1.20(CAP_VDD)
NetC50_2: C50.2 C51.2 R38.2 U1.55(VDD)
NetC52_2: C52.2 C53.2 R39.2 U1.56(VDD)
NetC54_2: C54.2 C55.2 R40.2 U1.7(VDD18)
NetC56_2: C56.2 C57.2 R41.2 U1.21(VDD18)
NetC60_2: C60.2 C61.2 R42.2 U1.24(VDDIO)
NetC62_2: C62.2 C63.2 R43.2 U1.30(VTERM)
NetC64_1: C64.1 L1.1 L9.2 R44.1
NetC65_1: C65.1 L3.1 L10.2 R45.1
NetC66_1: C66.1 L5.1 L11.2 R46.1
NetC67_1: C67.1 L7.1 L12.2 R47.1
NetF2_2: F2.2 L9.1
NetF3_2: F3.2 L10.1
NetF4_2: F4.2 L11.1
NetF5_2: F5.2 L12.1
NetL1_2: L1.2 L2.1 R44.2
NetL3_2: L3.2 L4.1 R45.2
NetL5_2: L5.2 L6.1 R46.2
NetL7_2: L7.2 L8.1 R47.2

Not connected (* = marked no-connect by the designer): D1 2(IO2) 4(IO3) 5(IO4) 6(NC) 7(NC) 9(NC); D2 1(IO1) 2(IO2) 4(IO3) 7(NC) 9(NC) 10(NC); D3 2(IO2) 4(IO3) 5(IO4) 6(NC) 7(NC) 9(NC); D4 1(IO1) 2(IO2) 4(IO3) 7(NC) 9(NC) 10(NC)

### Layout directives
net class 50SINGLE: RF_A, RF_B, RF_C, RF_D
differential pair; differential pair class CSI0: CKA_N, CKA_P, CKC_N, CKC_P, DA0_N, DA0_P, DA1_N, DA1_P, DA2_N, DA2_P, DA3_N, DA3_P
differential pair; differential pair class 100DIFF: SIOA_N, SIOA_P, SIOB_N, SIOB_P, SIOC_N, SIOC_P, SIOD_N, SIOD_P
differential pair: X25_N, X25_P
differential pair; differential pair class CSI1: CKB_N, CKB_P, CKF_N, CKF_P, DB0_N, DB0_P, DB1_N, DB1_P, DB2_N, DB2_P, DB3_N, DB3_P
net class PWR: (no net found under the mark), PoC_PWR
differential pair; differential pair class CSI0_PRE: CSI0_CK_N, CSI0_CK_P, CSI0_CKALT_N, CSI0_CKALT_P, CSI0_D0_N, CSI0_D0_P, CSI0_D1_N, CSI0_D1_P, CSI0_D2_N, CSI0_D2_P, CSI0_D3_N, CSI0_D3_P
differential pair; differential pair class CSI1_PRE: CSI1_CK_N, CSI1_CK_P, CSI1_CKALT_N, CSI1_CKALT_P, CSI1_D0_N, CSI1_D0_P, CSI1_D1_N, CSI1_D1_P, CSI1_D2_N, CSI1_D2_P, CSI1_D3_N, CSI1_D3_P

### Notes on the sheet
- (near C14) CSI + I2C + PoC IN
- GMSL Aggregator
- MAX96724 has internal pull up but I added more
- COAX Inputs
- (near R25) NOSTUFF
- COAX is ok as 50ohm single ended but remove ground plane from under the pads of passives connected to the GMSL trace
- PLACE COUPLING CAPS AS CLOSE AS POSSIBLE TO MAX96724
- (near R26) NOSTUFF
- (near R27) 3V3 OR 1V8 I/O???
- (near R28) CSI WIRING AS PER PAGE 23 OF MAX96724 DS
- Line fault?
- prob no since poc>>
- CAN ALSO JUST 10K PD
- GMSL2 3GB/s mode
- COAX +
- Table 7 and 8 of DS for CFG configs
- MAX96724FGTN/V+ is option with dual CSI out
- (near R35) I2C ADDR 0x5C
- (near R35) REMOVE PULLUP FOR 0x4E
- XRES --> 402 1% TO GND
  X1/X2 --> 30PF CAP --> 2*(CL-CSTRAY)
  SDA/SCL --> OK, EXTRA PULLUPS ADDED BUT INTERNAL ONES EXIST
  SDA1/SCL1 --> COULD CONVERT TO HSYNC/VSYNC FOR STATUS LEDS
  CFG1 --> GMSL2 3GB/s OVER COAX (TABLE 8 OF DS)
  CFG0 --> I2C ADDR (TABLE 7 OF DS)
  COMPONENT SUGGESTIONS IN TABLE 3 OF DS
  - DECOUPLING CAPS OK
- MAX96724 PIN CONFIGS
- FAKRA + ESD PROT
- POWER
- (near R?) FORGOT TO ADD THIS RESISTOR ON V1
- Maybe add switch + ldo if core current is high - it's 600mA on the 1V2 rail alone so yes
- Alas we require 1V2, 1V8, and 3V3 for these fuckers. Probably do buck for 3V3 and LDO for 1V2 and 1V8 but ask smarter humans first
- Maybe LDO for 3V3 would be worthwhile
- Using 1V0 on VDD would bypass the internal regulator, therefore 1V2 used
- TPs
- PoC Supply
- Using C-2L-500 Coilcraft (#3) circuit but replaced  1210POC-223
- UNLABELLED RESISTORS ARE 0402 JUMPERS
- Table 5 of gmsl2 hardware design guide from analog
- POWER OVER COAX DIRECTLY FROM BATT SHOULD BE FINE PROVIDED THERE'S ENOUGH FILTERING - CASS
- SERBAN THINKS THIS IS OK, MAY FIND MISTAKES WHILE ROUTING THOUGH
- Cable assembly --> 095-820-157-006
  Connector --> FM4-NZRP-PCB-1
- (in symbol CMP-015-00011-2, part A) 1 of 2
- (in symbol CMP-015-00011-2, part B) 2 of 2; NC PINS ARE DISCONNECTED IN MAX96724R; BUT CONNECTED IN MAX96724/F

### Library data of the parts
C14-C44 C46-C58 C60-C63 C68-C71 = CMP-001-00058-1: as C6 on sheet MAX96724_COUPON; Min Operating Temperature: -55°C; Mounting Technology: Surface Mount; Pins: 2; Case/Package: 0402; RoHS Compliant: Yes; Max Operating Temperature: 85°C
  C14-C19 C22-C24 C27-C33 C36-C38 C41 C44 C47 C49 C51 C53 C58 C68-C71: Value: 100n
  C20 C21 C25 C26 C34 C35 C39 C40: Value: 220n
  C42 C43: Value: 30p
  C46 C48 C50 C52 C54 C56 C60 C62: Value: 10u
  C55 C57 C61 C63: Value: 10n
C45 C59 = CMP-2006-02792-2: Chip Multilayer Ceramic Capacitors for General Purpose, 0603, 10uF, X5R, 15%, 20%, 6.3V; Packaging: Tape and Reel; Voltage Rating (DC): 6.3V; Width: 0.031inch; Termination: SMD/SMT; Dielectric: X5R; Package Quantity: 4000; Voltage Rating: 6.3V; Capacitance: 10uF; Case/Package: 0603; Min Operating Temperature: -55°C; Voltage: 6.3V; Length: 1.6mm; Thickness: 0.035inch; Lead Free: Lead Free; Depth: 0.8mm; Case Code (Imperial): 0603; Max Operating Temperature: 85°C; Material: Ceramic; Height: 0.8mm; Tolerance: 20%; Mount: Surface Mount; REACH SVHC: No SVHC; Radiation Hardening: No; Case Code (Metric): 1608
C64-C67 = CMP-2007-03222-3: as C3 on sheet MAX96724_COUPON; Case/Package: 0805; Depth: 1.25mm; Resistor Type: Ceramic; Voltage Rating: 25V; Lead Free: Lead Free; Voltage Rating (DC): 25V; Case Code (Metric): 2012; Thickness: 0.057inch; REACH SVHC: No SVHC; Material: Ceramic; Tolerance: 20%; Length: 2mm; Capacitance: 22uF; Case Code (Imperial): 0805; Max Operating Temperature: 85°C; Termination: SMD/SMT; Weight: 0.000335oz; Dielectric: X5R; Packaging: Tape and Reel; Voltage: 25V; Package Quantity: 3000; Height: 1.25mm; Mount: Surface Mount; Width: 1.25mm; Min Operating Temperature: -55°C
D1-D4 = CMP-04989-000002-1: 4-CHANNEL LOW-CAPACITANCE SURGE; Manufacturer: Texas Instruments; Value: 0.55pF; Reverse Standoff Voltage: 3.6V; Standoff Height: 0mm; Breakdown Voltage: 5.5V; Peak Pulse Current: 5.5A; Clamping Voltage: 11.5V; Direction: Bidirectional; Peak Pulse Power: 50W; Number Of Channels: 4; Ambient Temperature Range High: +125°C; ComponentLink2Description: Datasheet; Height: 0.55mm; Lead Free: Yes; Device Class L3: unset; Temperature Range High: +125°C; Temperature Range Low: -40°C; Package: DQA0010A; Temperature: -40°C to +125°C; Capacitance: 0.55pF; RoHS: TRUE; Mouser Description: 4-Channel Low-Capacitance Surge and ESD Protection Diode 10-USON -40 to 125; Category: Diode; Device Class L1: Circuit Protection; Octopart: https://octopart.com/esd204dqar-texas+instruments-89917476; Device Class L2: TVS Diodes; Ambient Temperature Range Low: -40°C; Manufacturer Part Number: ESD204DQAR; ComponentLink2URL: http://www.ti.com/lit/ds/symlink/esd204.pdf; Automotive: No; Digikey Description: 4-CHANNEL LOW-CAPACITANCE SURGE
F2-F5 = CMP-08606-000071-1: PTC RESET FUSE 60V 500MA 2920; Resistance: 1.4R; Trip Current: 1A; Power Dissipation: 1.5W; Time to Trip: 4s; Approvals: cULus; Current Rating: 10A; Operating Supply Voltage: 60V; Termination: SMD/SMT; Width: 5.44mm; Case/Package: 2920; Series: 2920L; Case Code (Imperial): 2920; Height: 1.25mm; Hold Current: 500mA; Terminal Material: Copper; Min Operating Temperature: -40°C; Package Quantity: 1500; Max Voltage Rating (DC): 60V; RoHS Compliant: Yes; Case Code (Metric): 7351; Lead Free: Lead Free; Max Operating Temperature: 85°C; Voltage Rating (DC): 60V; Working Voltage: 60V; Length: 7.98mm; REACH SVHC: No SVHC; Max Current Rating: 10A; Voltage Rating: 60V; Packaging: Tape and Reel
J8 = CMP-002-00044-3: Connector RF Mini-FAKRA Plug 9GHz 50Ohm Solder Right Angle Through Hole; Component Type: Standard; Pins: 9; Source: fakra4ch.SchLib; Design Item ID: CMP-002-00085-1
L1 L3 L5 L7 = CMP-11268-000041-1: NOT COILCRAFT - ACTUAL P# --> ADL32VHC-220M / - Power Injection Chokes for PoC; Manufacturer Part Number: 1210POC-223MRC; Value: 22uH; Core Material: Ferrite; Saturation Current: 720mA; Series Resistance: 0.88Ω; Rms Current: 700mA; Automotive Grade: Grade 1; Self Resonant Frequency: 70MHz; Test Frequency: 100kHz; Tolerance: 20%; Ambient Temperature Range High: +125°C; Manufacturer: coilcraft; Octopart: https://octopart.com/1210poc-223mrc-coilcraft-103207315; Category: Ind; Device Class L2: Inductors; RoHS: TRUE; Device Class L3: Fixed Inductors; Package: 1210POC; Ambient Temperature Range Low: -40°C; ComponentLink2URL: https://drive.google.com/open?id=15FlOq8Y4YbRFohfA_cJ40jgnqs8va2Mh; Lead Free: Yes; Inductance: 22uH; Device Class L1: Passive Components; ComponentLink2Description: Datasheet; Automotive: Yes; Height: 3mm
L2 L4 L6 L8 = CMP-11268-000007-1: Fixed Inductors PFL1609 Low Profile 0.56 uH 20 % 1.4 A; Manufacturer: coilcraft; Rms Current: 1100mA; Self Resonant Frequency: 600MHz; Core Material: Composite; Tolerance: 20%; Value: 0.56uH; Automotive Grade: Grade 1; Saturation Current: 710mA; Test Frequency: 7.9MHz; Shielding: true; Series Resistance: 130mΩ; Lead Free: Yes; Device Class L1: Passive Components; Package: PFL1609; Octopart: https://octopart.com/pfl1609-561mew-coilcraft-20329171; ComponentLink2URL: https://www.coilcraft.com/pdfs/pfl1609.pdf; Manufacturer Part Number: PFL1609-561MEW; Ambient Temperature Range Low: -40°C; Composition: Wirewound; Inductance: 0.56uH; Device Class L2: Inductors; Category: Ind; Device Class L3: Fixed Inductors; Mouser Description: Fixed Inductors PFL1609 Low Profile 0.56 uH 20 % 1.4 A; Automotive: Yes; ComponentLink2Description: Datasheet; Ambient Temperature Range High: +105°C; Height: 0.95mm; RoHS: TRUE
L9-L12 = CMP-0227-00094-3: NexarPartId: 8917123; Current Rating: 1.2A; Shielding: Shielded; Core Material: Ferrite; Inductance: 100µH; Test Frequency: 100kHz; Tolerance: 30%; Resistance: 255mΩ; Self Resonant Frequency: 6MHz; Composition: Wirewound; Packaging: Cut Tape (CT); REACH SVHC: Unknown; Number of Pins: 2; Max DC Current: 1.2A; Saturation Current: 1.2A; Ambient Temperature Range High: 95°C; Weight: 1.273007g; Height: 3.8mm; Width: 10mm; Min Operating Temperature: -40°C; Max Operating Temperature: 125°C; Termination: SMD/SMT; Height - Seated (Max): 4.0894mm; Length: 10mm; RMS Current (Irms): 1.2A; Ambient Temperature Range Low: -40°C; RoHS: Compliant; Mount: Surface Mount; Depth: 10mm; DC Resistance (DCR): 255mΩ; Inductance Tolerance: 30%; Case/Package: Nonstandard
R25 R26 = CMP-2000-00336-1: Manufacturer: Panasonic; Part Number: ERJ3EKF2201V
R27 = CMP-2000-00484-1: Manufacturer: Panasonic; Part Number: ERJ-3EKF4020V
R28 = CMP-1012-00623-3: Chip Resistor, 10 KOhm, +/- 1%, 0.1 W, -55 to 155 degC, 0603 (1608 Metric), RoHS, Tape and Reel; Manufacturer: Panasonic; Voltage Rating: 75V; Case\/Package: 0603; Power Rating: 100mW; Resistance: 10KOhm; Temperature Coefficient: 100ppm\/degreesC; Number of Pins: 2; Package Reference: 603; Depth: 0.8mm; Mount: SurfaceMount; Package Description: 2-Pin Surface Mount Device, Body 1.6 x 0.85 mm; Datasheet Version: 02/2017; Length: 1.6mm; Lead Free: LeadFree; Height: 0.45mm; Number of Terminations: 2; Max Power Dissipation: 100mW; Min Operating Temperature: -55degC; Datasheet URL: https://industrial.panasonic.com/cdbs/www-data/pdf/RDA0000/AOA0000C304.pdf; Termination: SMD/SMT; Case Code (Metric): 1608; Case Code (Imperial): 0603; Tolerance: 1%; Max Operating Temperature: 155degC; RoHSCompliant: true; Voltage Rating (DC): 75V; Radiation Hardening: No; Packaging: TapeandReel; Composition: ThickFilm; Mounting Technology: SurfaceMount; Manufacturer URL: http://www.panasonic.com/; Width: 0.031inch; REACH SVHC: NoSVHC; Contact Plating: Tin; Military Standard: Not; Package Quantity: 1
R29 R30 R36 R37 = CMP-2000-00538-1: Manufacturer: Panasonic; Part Number: ERJ-3EKF49R9V
R31 R32 = CMP-2000-00651-1: Manufacturer: Panasonic; Part Number: ERJ-3EKF8062V
R34 R35 = CMP-2000-00323-1: Manufacturer: Panasonic; Part Number: ERJ-3EKF2052V
R38-R43 = CMP-1011-00001-2: Manufacturer: Yageo / Phycomp; Part Number: RC0402JR-070RL
R44-R47 = CMP-2000-00540-8: RES SMD 5.1K OHM 1% 1/10W 0603; Power Rating: 100mW; Temperature Coefficient: 100ppm/°C; Voltage Rating: 75V; Resistance: 5.1kR; Military Standard: Not; Case/Package: 0603; Packaging: Tape and Reel; Package Quantity: 1; Reach SVHC Compliant: Yes; Lead Free: Lead Free; Mount: Surface Mount; Size Code: 0603; Depth: 0.8mm; Resistance Tolerance: 1%; Number of Terminations: 2; Resistor Type: Thick Film; Width: 0.8mm; Construction: Rectangular; Series: ERJ; Radiation Hardening: No; Max Operating Temperature: 155°C; Features: Automotive AEC-Q200; Tolerance: 1%; Voltage Rating (DC): 75V; Length: 1.6mm; RoHS Compliant: Yes; Min Operating Temperature: -55°C; Case Code (Metric): 1608; Termination: SMD/SMT; Weight: 7.1E-05oz; Max Power Dissipation: 100mW; Contact Plating: Tin; Height: 0.022inch; Case Code (Imperial): 0603
R? = CMP-009-00002-14: Resistor
TP22-TP34 = CMP-00025-2: Test Point .6mm
U1 = CMP-015-00011-2: Quad Tunneling GMSL2/1 to CSI-2 Deserializer
U2 = CMP-0244-00308-1: Fixed Low Drop Positive Voltage Regulator, 1.8V, 4-Pin SOT-223, Tape and Reel; ComponentLink1URL: http://www.st.com; PackageReference: SOT-223; PackageDescription: 4-Pin SOT-223 Package, 6.5 x 3.5 mm Body, 2.3 mm Pitch, 7 mm Lead Span; ComponentLink2URL: http://www.st.com/internet/com/TECHNICAL_RESOURCES/TECHNICAL_LITERATURE/DATASHEET/CD00000544.pdf; ComponentLink2Description: Datasheet; ComponentLink1Description: Manufacturer URL; DatasheetVersion: 1/11/2011; PackageVersion: 2010
U3 = CMP-0244-00318-1: Fixed Low Drop Positive Voltage Regulator, 1.2V, 4-Pin SOT-223, Tape and Reel; PackageDescription: 4-Pin SOT-223 Package, 6.5 x 3.5 mm Body, 2.3 mm Pitch, 7 mm Lead Span; PackageVersion: 2010; ComponentLink2Description: Datasheet; PackageReference: SOT-223; ComponentLink2URL: http://www.st.com/internet/com/TECHNICAL_RESOURCES/TECHNICAL_LITERATURE/DATASHEET/CD00000544.pdf; ComponentLink1Description: Manufacturer URL; DatasheetVersion: 1/11/2011; ComponentLink1URL: http://www.st.com
Y1 = CMP-2000-05733-3: Crystal 25MHz ±20ppm (Tol) ±30ppm (Stability) 18pF FUND 60Ω 4-Pin SMD T/R; Series Resistance: 60R; Length: 3.2mm; Depth: 2.5mm; Packaging: Tape and Reel; Min Operating Temperature: -40°C; Operating Frequency: 25 MHz; Lead Free: Lead Free; Number of Pins: 4; Frequency Tolerance: 20ppm; Radiation Hardening: No; Max Operating Temperature: 85°C; Termination: SMD/SMT; Frequency Stability: 30ppm; Frequency: 25MHz; Series: ABM8G; Mount: Surface Mount; Package Quantity: 1000; Height: 0.039inch; Width: 0.098inch; Case/Package: CSMD; ESR (Equivalent Series Resistance): 60R; Load Capacitance: 18pF; Tolerance: 20ppm

## Nets that join several sheets
3V3_AUX: MAX96724_COUPON (6 pins), GMSL_DESERIALIZER (6 pins)
GND: MAX96724_COUPON (33 pins), GMSL_DESERIALIZER (52 pins)
LO_VCC: MAX96724_COUPON (J6.1 P1.2), GMSL_DESERIALIZER (C44.2 C58.2 U2.3 U3.3)
CAM_I2C_SCL: MAX96724_COUPON (5 pins), GMSL_DESERIALIZER (R26.1 TP24.1 U1.29)
CAM_I2C_SDA: MAX96724_COUPON (5 pins), GMSL_DESERIALIZER (R25.1 TP22.1 U1.28)
CSI0_CK_N: MAX96724_COUPON (J1.8), GMSL_DESERIALIZER (C27.2)
CSI0_CK_P: MAX96724_COUPON (J1.9), GMSL_DESERIALIZER (C24.2)
CSI0_CKALT_N: MAX96724_COUPON (J2.8), GMSL_DESERIALIZER (C69.1)
CSI0_CKALT_P: MAX96724_COUPON (J2.9), GMSL_DESERIALIZER (C68.1)
CSI0_D0_N: MAX96724_COUPON (J1.2), GMSL_DESERIALIZER (C15.2)
CSI0_D0_P: MAX96724_COUPON (J1.3), GMSL_DESERIALIZER (C14.2)
CSI0_D1_N: MAX96724_COUPON (J1.5), GMSL_DESERIALIZER (C17.2)
CSI0_D1_P: MAX96724_COUPON (J1.6), GMSL_DESERIALIZER (C16.2)
CSI0_D2_N: MAX96724_COUPON (J2.2), GMSL_DESERIALIZER (C19.2)
CSI0_D2_P: MAX96724_COUPON (J2.3), GMSL_DESERIALIZER (C18.2)
CSI0_D3_N: MAX96724_COUPON (J2.5), GMSL_DESERIALIZER (C23.2)
CSI0_D3_P: MAX96724_COUPON (J2.6), GMSL_DESERIALIZER (C22.2)
CSI1_CK_N: MAX96724_COUPON (J3.8), GMSL_DESERIALIZER (C41.2)
CSI1_CK_P: MAX96724_COUPON (J3.9), GMSL_DESERIALIZER (C38.2)
CSI1_CKALT_N: MAX96724_COUPON (J4.8), GMSL_DESERIALIZER (C71.1)
CSI1_CKALT_P: MAX96724_COUPON (J4.9), GMSL_DESERIALIZER (C70.1)
CSI1_D0_N: MAX96724_COUPON (J3.2), GMSL_DESERIALIZER (C29.2)
CSI1_D0_P: MAX96724_COUPON (J3.3), GMSL_DESERIALIZER (C28.2)
CSI1_D1_N: MAX96724_COUPON (J3.5), GMSL_DESERIALIZER (C31.2)
CSI1_D1_P: MAX96724_COUPON (J3.6), GMSL_DESERIALIZER (C30.2)
CSI1_D2_N: MAX96724_COUPON (J4.2), GMSL_DESERIALIZER (C33.2)
CSI1_D2_P: MAX96724_COUPON (J4.3), GMSL_DESERIALIZER (C32.2)
CSI1_D3_N: MAX96724_COUPON (J4.5), GMSL_DESERIALIZER (C37.2)
CSI1_D3_P: MAX96724_COUPON (J4.6), GMSL_DESERIALIZER (C36.2)
MFP0: MAX96724_COUPON (J9.2), GMSL_DESERIALIZER (TP26.1 U1.1)
MFP1: MAX96724_COUPON (J9.3), GMSL_DESERIALIZER (TP28.1 U1.2)
MFP2: MAX96724_COUPON (J9.4), GMSL_DESERIALIZER (TP30.1 U1.3)
MFP3: MAX96724_COUPON (J9.5), GMSL_DESERIALIZER (TP23.1 U1.12)
MFP4: MAX96724_COUPON (J9.6), GMSL_DESERIALIZER (TP25.1 U1.13)
MFP5: MAX96724_COUPON (J9.7), GMSL_DESERIALIZER (TP27.1 U1.14)
MFP7: MAX96724_COUPON (J9.8), GMSL_DESERIALIZER (TP31.1 U1.26)
MFP8: MAX96724_COUPON (J9.9), GMSL_DESERIALIZER (TP33.1 U1.27)
nPWDN: MAX96724_COUPON (J9.1), GMSL_DESERIALIZER (R28.1 TP32.1 U1.11)
PoC_PWR: MAX96724_COUPON (7 pins), GMSL_DESERIALIZER (F2.1 F3.1 F4.1 F5.1)